# EAGLE design io_expansion_board (EAGLE 8.4.0)
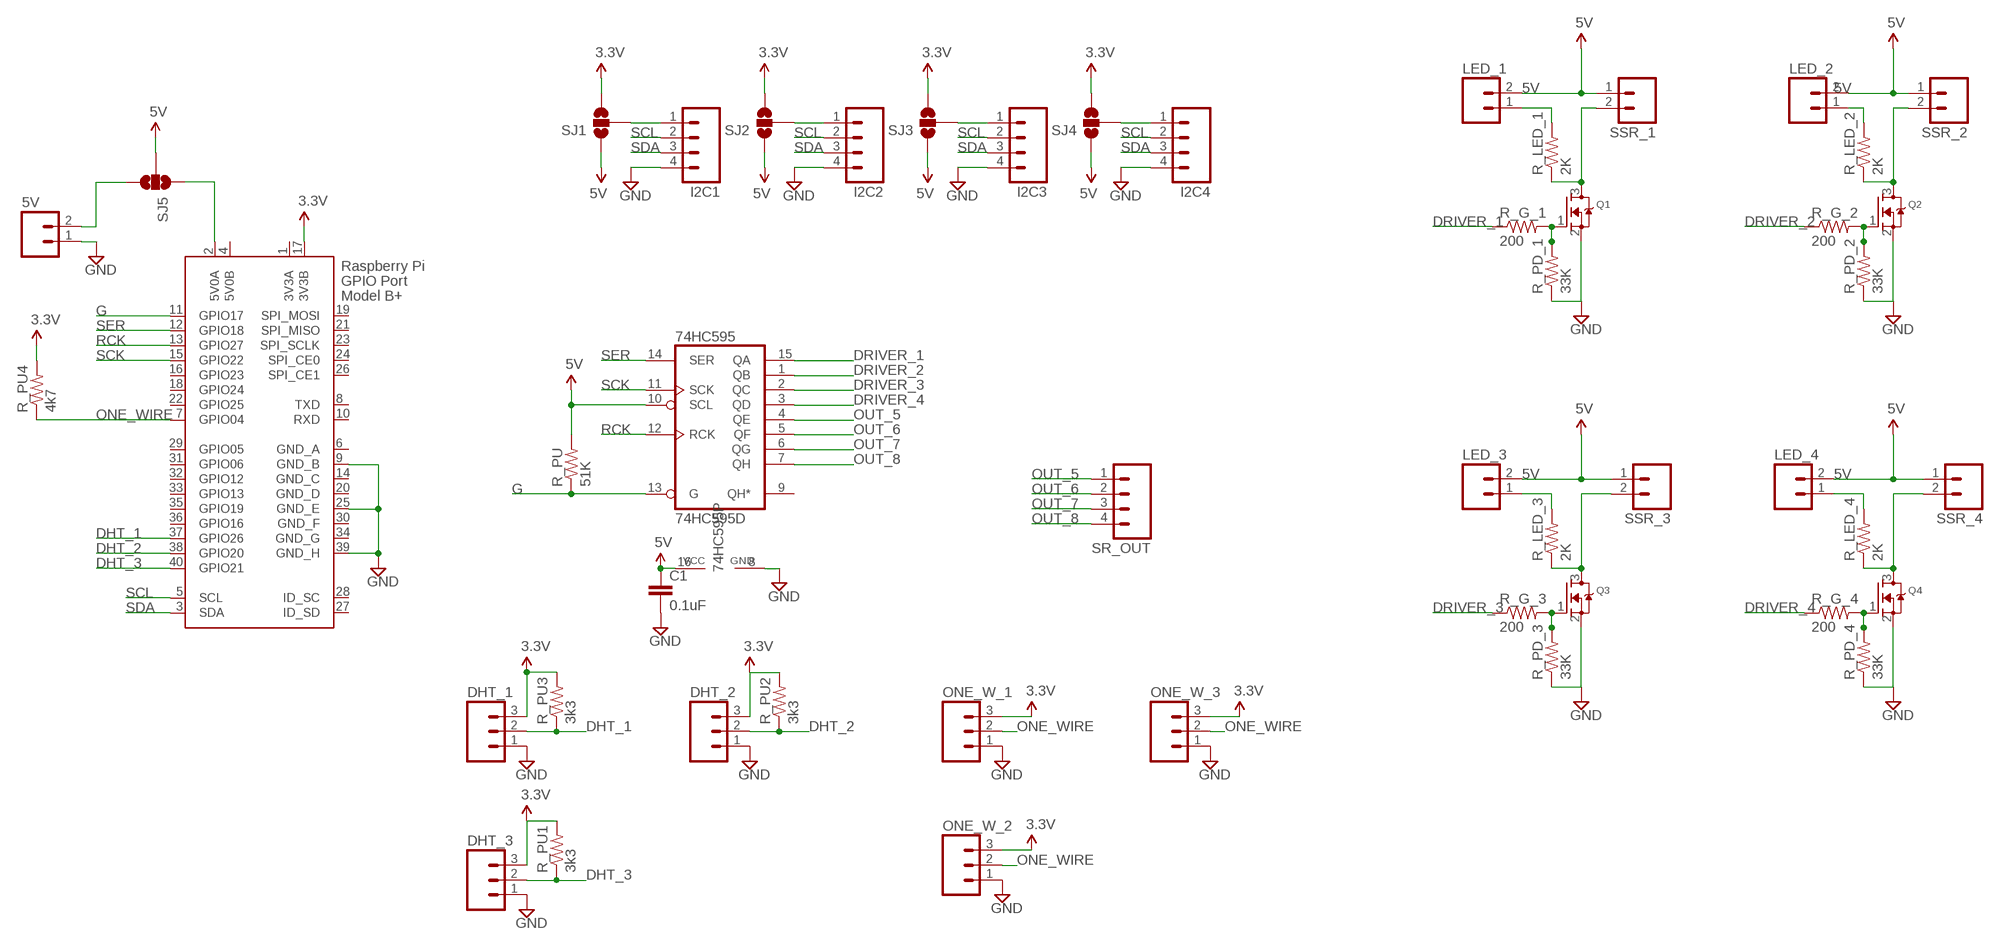
[diagram p0: schematic, sheet 1]

## Parts
5V  M023.5MM  [SCREWTERMINAL-3.5MM-2]
74HC595  74HC595D  [SO16]
C1  0.1uF  0.1UF-25V(+80/-20%)(0603)  [0603-CAP]
DHT_1  M03POLAR  [MOLEX-1X3]
DHT_2  M03POLAR  [MOLEX-1X3]
DHT_3  M03POLAR  [MOLEX-1X3]
I2C1  M04PTH  [1X04]
I2C2  M04PTH  [1X04]
I2C3  M04PTH  [1X04]
I2C4  M04PTH  [1X04]
LED_1  M02PTH  [1X02]
LED_2  M02PTH  [1X02]
LED_3  M02PTH  [1X02]
LED_4  M02PTH  [1X02]
ONE_W_1  M03POLAR  [MOLEX-1X3]
ONE_W_2  M03POLAR  [MOLEX-1X3]
ONE_W_3  M03POLAR  [MOLEX-1X3]
Q1  MOSFET-NREFLOW  [SOT23]
Q2  MOSFET-NREFLOW  [SOT23]
Q3  MOSFET-NREFLOW  [SOT23]
Q4  MOSFET-NREFLOW  [SOT23]
R_G_1  200  RESISTOR0603  [0603-RES]
R_G_2  200  RESISTOR0603  [0603-RES]
R_G_3  200  RESISTOR0603  [0603-RES]
R_G_4  200  RESISTOR0603  [0603-RES]
R_LED_1  2K  RESISTOR0603  [0603-RES]
R_LED_2  2K  RESISTOR0603  [0603-RES]
R_LED_3  2K  RESISTOR0603  [0603-RES]
R_LED_4  2K  RESISTOR0603  [0603-RES]
R_PD_1  33K  RESISTOR0603  [0603-RES]
R_PD_2  33K  RESISTOR0603  [0603-RES]
R_PD_3  33K  RESISTOR0603  [0603-RES]
R_PD_4  33K  RESISTOR0603  [0603-RES]
R_PU  51K  RESISTOR0603  [0603-RES]
R_PU1  3k3  RESISTOR0603  [0603-RES]
R_PU2  3k3  RESISTOR0603  [0603-RES]
R_PU3  3k3  RESISTOR0603  [0603-RES]
R_PU4  4k7  RESISTOR0603  [0603-RES]
SJ1  SOLDERJUMPER_2WAYS  [SJ_3]
SJ2  SOLDERJUMPER_2WAYS  [SJ_3]
SJ3  SOLDERJUMPER_2WAYS  [SJ_3]
SJ4  SOLDERJUMPER_2WAYS  [SJ_3]
SJ5  SOLDERJUMPER_2WAYS  [SJ_3]
SR_OUT  M04PTH  [1X04]
SSR_1  M02PTH  [1X02]
SSR_2  M02PTH  [1X02]
SSR_3  M02PTH  [1X02]
SSR_4  M02PTH  [1X02]
X2  RASPI_BOARD_B+#_HDC  [RASPI_BOARD_B+HAT_DF_CF]

## Nets
3.3V: DHT_1.3 DHT_2.3 DHT_3.3 ONE_W_1.3 ONE_W_2.3 ONE_W_3.3 R_PU1.2 R_PU2.2 R_PU3.2 R_PU4.2 SJ1.3 SJ2.3 SJ3.3 SJ4.3 X2.17(3V3B)
5V: 74HC595.10(SCL) 74HC595.16(VCC) C1.1 LED_1.2 LED_2.2 LED_3.2 LED_4.2 R_PU.2 SJ1.1 SJ2.1 SJ3.1 SJ4.1 SJ5.2 SSR_1.1 SSR_2.1 SSR_3.1 SSR_4.1
DHT_1: DHT_1.2 R_PU3.1 X2.37(GPIO26)
DHT_2: DHT_2.2 R_PU2.1 X2.38(GPIO20)
DHT_3: DHT_3.2 R_PU1.1 X2.40(GPIO21)
DRIVER_1: 74HC595.15(QA) R_G_1.1
DRIVER_2: 74HC595.1(QB) R_G_2.1
DRIVER_3: 74HC595.2(QC) R_G_3.1
DRIVER_4: 74HC595.3(QD) R_G_4.1
G: 74HC595.13(G) R_PU.1 X2.11(GPIO17)
GND: 5V.1 74HC595.8(GND) C1.2 DHT_1.1 DHT_2.1 DHT_3.1 I2C1.4(GND) I2C2.4(GND) I2C3.4(GND) I2C4.4(GND) ONE_W_1.1 ONE_W_2.1 ONE_W_3.1 Q1.2(S) Q2.2(S) Q3.2(S) Q4.2(S) R_PD_1.1 R_PD_2.1 R_PD_3.1 R_PD_4.1 X2.9(GND_B) X2.25(GND_E) X2.39(GND_H)
N$1: Q2.1(G) R_G_2.2 R_PD_2.2
N$2: Q2.3(D) R_LED_2.1 SSR_2.2
N$3: LED_2.1 R_LED_2.2
N$4: Q3.1(G) R_G_3.2 R_PD_3.2
N$5: Q1.1(G) R_G_1.2 R_PD_1.2
N$6: Q1.3(D) R_LED_1.1 SSR_1.2
N$7: LED_1.1 R_LED_1.2
N$8: Q3.3(D) R_LED_3.1 SSR_3.2
N$9: LED_3.1 R_LED_3.2
N$10: Q4.1(G) R_G_4.2 R_PD_4.2
N$11: Q4.3(D) R_LED_4.1 SSR_4.2
N$12: LED_4.1 R_LED_4.2
N$13: I2C1.1(SCL) SJ1.2
N$14: I2C2.1(SCL) SJ2.2
N$15: I2C3.1(SCL) SJ3.2
N$16: I2C4.1(SCL) SJ4.2
N$17: SJ5.1 X2.2(5V0A)
N$18: 5V.2 SJ5.3
ONE_WIRE: ONE_W_1.2 ONE_W_2.2 ONE_W_3.2 R_PU4.1 X2.7(GPIO04)
OUT_5: 74HC595.4(QE) SR_OUT.1(SCL)
OUT_6: 74HC595.5(QF) SR_OUT.2(SDA)
OUT_7: 74HC595.6(QG) SR_OUT.3(VCC)
OUT_8: 74HC595.7(QH) SR_OUT.4(GND)
RCK: 74HC595.12(RCK) X2.13(GPIO27)
SCK: 74HC595.11(SCK) X2.15(GPIO22)
SCL: I2C1.2(SDA) I2C2.2(SDA) I2C3.2(SDA) I2C4.2(SDA) X2.5(SCL)
SDA: I2C1.3(VCC) I2C2.3(VCC) I2C3.3(VCC) I2C4.3(VCC) X2.3(SDA)
SER: 74HC595.14(SER) X2.12(GPIO18)
Unconnected: 74HC595.9(QH*) X2.8(TXD) X2.10(RXD) X2.16(GPIO23) X2.18(GPIO24) X2.19(SPI_MOSI) X2.21(SPI_MISO) X2.22(GPIO25) X2.23(SPI_SCLK) X2.24(SPI_CE0) X2.26(SPI_CE1) X2.27(ID_SD) X2.28(ID_SC) X2.29(GPIO05) X2.31(GPIO06) X2.32(GPIO12) X2.33(GPIO13) X2.35(GPIO19) X2.36(GPIO16)

## Power pins joined to a net without a drawn wire
3V3A: X2.1(3V3A)
5V0B: X2.4(5V0B)
GND_A: X2.6(GND_A)
GND_C: X2.14(GND_C)
GND_D: X2.20(GND_D)
GND_F: X2.30(GND_F)
GND_G: X2.34(GND_G)

## Library data of the parts
5V = SparkFun-Connectors:M02: Standard 2-pin 0.1" header. Use with - straight break away headers ( PRT-00116) - right angle break away headers (PRT-00553) - swiss pins (PRT-00743) - machine pins (PRT-00117) - female headers (PRT-00115) Molex polarized connector foot print use with: PRT-08233 with associated crimp pins and housings. 2.54_SCREWTERM for use with PRT-10571. 3.5mm Screw Terminal footprints for PRT-08084 5mm Screw Terminal footprints for use with PRT-08432; PROD_ID: CONN-08399
74HC595 = 74xx-eu:74*595: 8-bit SHIFT REGISTER, output latch
C1 = SparkFun-Capacitors:0.1UF-25V(+80/-20%)(0603): CAP-00810 Ceramic Standard decoupling cap; PROD_ID: CAP-00810
DHT_1-DHT_3 ONE_W_1-ONE_W_3 = SparkFun-Connectors:M03: Header 3 Standard 3-pin 0.1" header. Use with straight break away headers (SKU : PRT-00116), right angle break away headers (PRT-00553), swiss pins (PRT-00743), machine pins (PRT-00117), and female headers (PRT-00115). Molex polarized connector foot print use with SKU : PRT-08232 with associated crimp pins and housings.
I2C1-I2C4 SR_OUT = SparkFun-Connectors:M04: Header 4 Standard 4-pin 0.1" header. Use with straight break away headers (SKU : PRT-00116), right angle break away headers (PRT-00553), swiss pins (PRT-00743), machine pins (PRT-00117), and female headers (PRT-00115). Molex polarized connector foot print use with SKU : PRT-08231 with associated crimp pins and housings. 1MM SMD Version SKU: PRT-10208
LED_1-LED_4 SSR_1-SSR_4 = SparkFun-Connectors:M02: Standard 2-pin 0.1" header. Use with - straight break away headers ( PRT-00116) - right angle break away headers (PRT-00553) - swiss pins (PRT-00743) - machine pins (PRT-00117) - female headers (PRT-00115) Molex polarized connector foot print use with: PRT-08233 with associated crimp pins and housings. 2.54_SCREWTERM for use with PRT-10571. 3.5mm Screw Terminal footprints for PRT-08084 5mm Screw Terminal footprints for use with PRT-08432
Q1-Q4 = adafruit:MOSFET-N: N-Channel Mosfet 2N7002E - 60V 260mA SOT23 [Digikey: 2N7002ET1GOSTR-ND] - REEL BSH103 - 30V 850mA SOT23 [Digikey: 568-5013-1-ND]
R_G_1-R_G_4 R_LED_1-R_LED_4 R_PD_1-R_PD_4 R_PU R_PU1-R_PU4 = SparkFun-Resistors:RESISTOR: Resistor Basic schematic elements and footprints for 0603, 1206, and PTH resistors.
SJ1-SJ5 = SparkFun-Retired:SOLDERJUMPER_2WAY: Solder Jumper 2 way solder jumper
X2 = raspberrypi_bastelstube_v13:RASPI_BOARD_B+#: Raspberry Pi GPIO connector with markings for the outer dimensions of the Raspberry Pi board model B+ with different sets of drill holes or mounting pads All pins connected

## Board
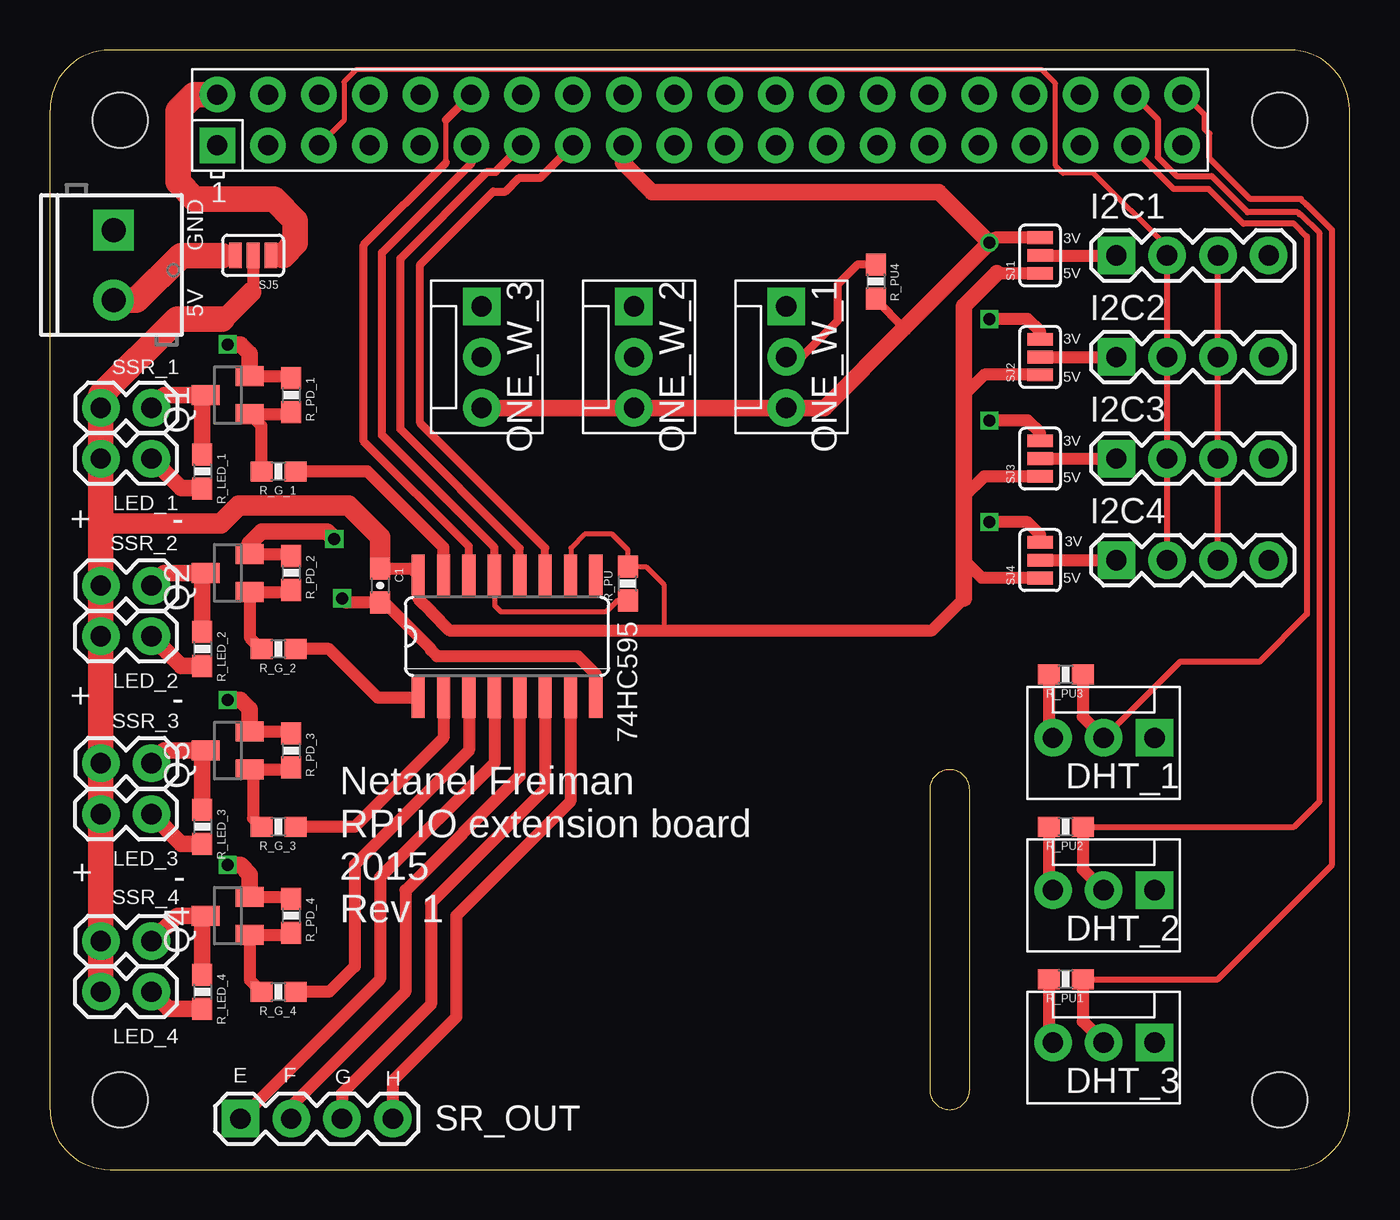
[diagram p1: board, top side]
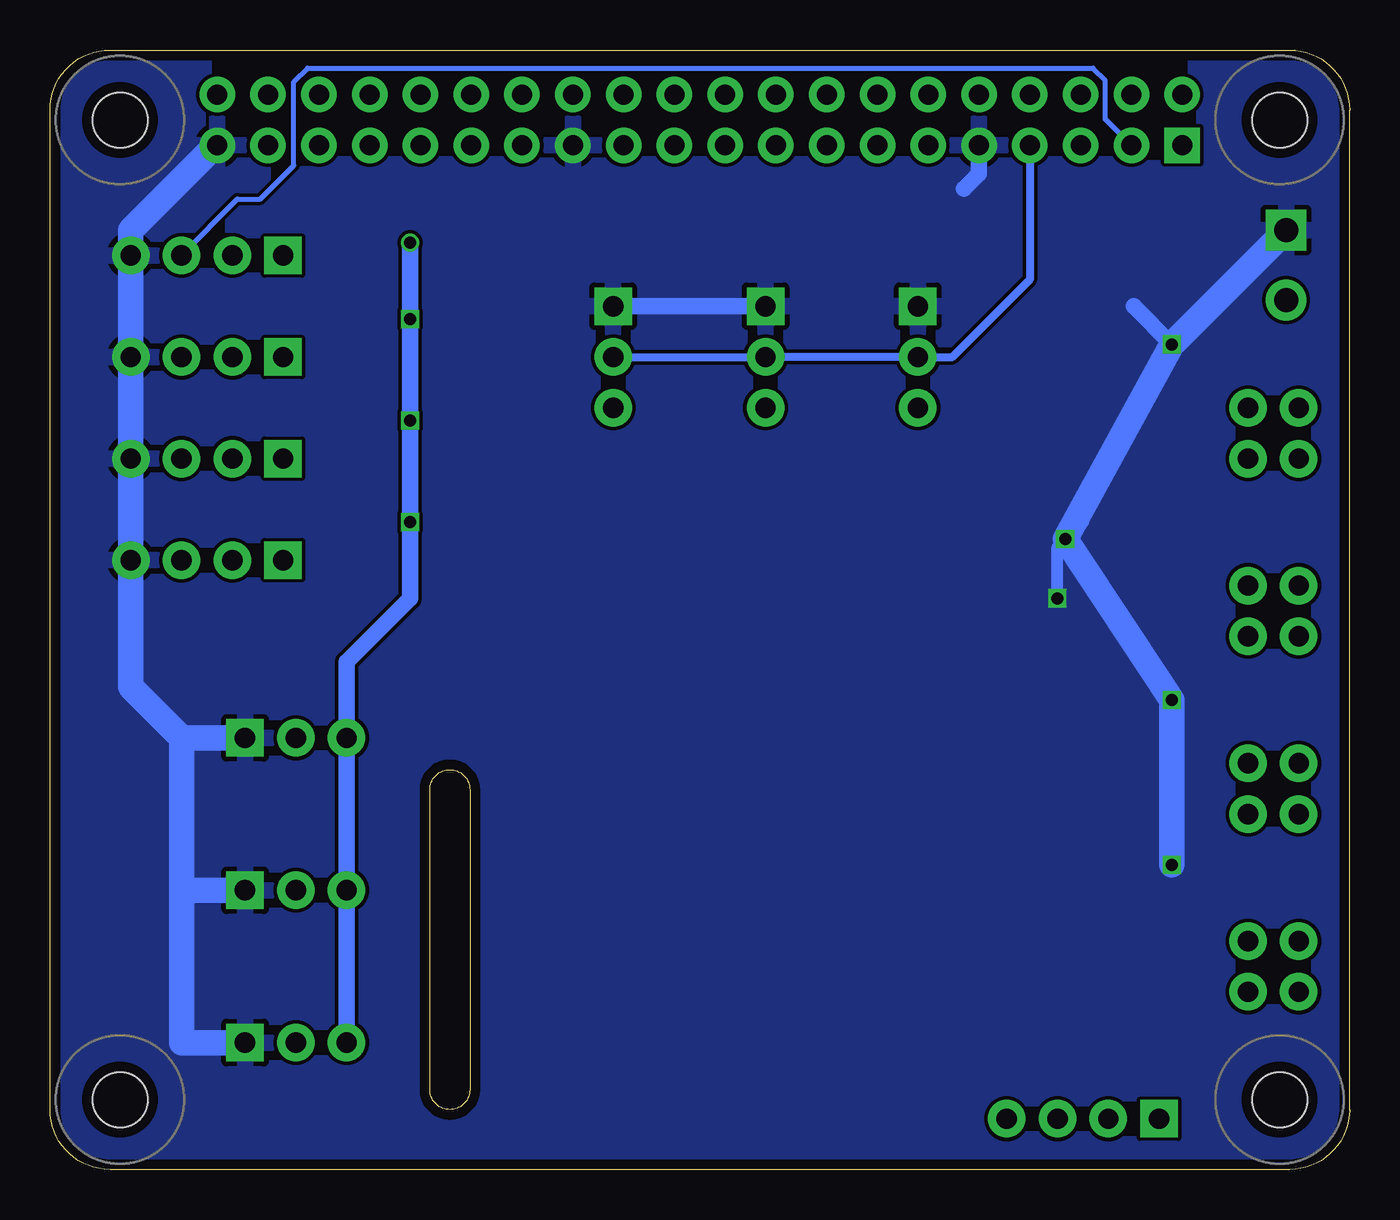
[diagram p2: board, bottom side, seen from below]

Size 65 x 56 mm. Coordinates in mm from the lower left corner, seen from the top.
Copper layers (1*16): Top 0.035mm / dielectric 1.5mm / Bottom 0.035mm
Design rules "SmartprototypingEagleRules": minimum track width 7mil, minimum drill 12mil, track to track 7mil, track to pad 7mil, pad to pad 7mil, via to via 7mil, smd to smd 0mil, copper to edge 20mil, drill to drill 10mil, minimum pad ring 10mil, minimum via ring 6mil, stop-mask expansion 2mil, vias tented up to drill 25mil, thermal gap 10mil

### Footprints (pad centres in the part's own frame; a part is rotated, then mirrored left to right if it is on the bottom)
SCREWTERMINAL-3.5MM-2 = drill 1.2 pad 2.032 square: 1 0,0 | drill 1.2 pad 2.032: 2 3.5,0
SO16 = smd 0.66 x 2.032: 1 -4.445,-3.073; 2 -3.175,-3.073; 3 -1.905,-3.073; 4 -0.635,-3.073; 5 0.635,-3.073; 6 1.905,-3.073; 7 3.175,-3.073; 8 4.445,-3.073; 9 4.445,3.073; 10 3.175,3.073; 11 1.905,3.073; 12 0.635,3.073; 13 -0.635,3.073; 14 -1.905,3.073; 15 -3.175,3.073; 16 -4.445,3.073
0603-CAP = smd 1.1 x 1: 1 -0.85,0; 2 0.85,0
MOLEX-1X3 = drill 1.016 pad 1.88 square: 1 0,0 | drill 1.016 pad 1.88: 2 2.54,0; 3 5.08,0
1X04 = drill 1.016 pad 1.88 square: 1 0,0 | drill 1.016 pad 1.88: 2 2.54,0; 3 5.08,0; 4 7.62,0
1X02 = drill 1.016 pad 1.88: 1 0,0; 2 2.54,0
SOT23 = smd 1 x 1.4: 1 -0.95,-1.1; 2 0.95,-1.1; 3 0,1.1
0603-RES = smd 1.1 x 1: 1 -0.85,0; 2 0.85,0
SJ_3 = smd 0.635 x 1.27: 1 -0.889,0; 2 0,0; 3 0.889,0
RASPI_BOARD_B+HAT_DF_CF = drill 1 pad 1.778 square: 1 8.37,51.23 | drill 1 pad 1.778: 2 8.37,53.77; 3 10.91,51.23; 4 10.91,53.77; 5 13.45,51.23; 6 13.45,53.77; 7 15.99,51.23; 8 15.99,53.77; 9 18.53,51.23; 10 18.53,53.77; 11 21.07,51.23; 12 21.07,53.77; 13 23.61,51.23; 14 23.61,53.77; 15 26.15,51.23; 16 26.15,53.77; 17 28.69,51.23; 18 28.69,53.77; 19 31.23,51.23; 20 31.23,53.77; 21 33.77,51.23; 22 33.77,53.77; 23 36.31,51.23; 24 36.31,53.77; 25 38.85,51.23; 26 38.85,53.77; 27 41.39,51.23; 28 41.39,53.77; 29 43.93,51.23; 30 43.93,53.77; 31 46.47,51.23; 32 46.47,53.77; 33 49.01,51.23; 34 49.01,53.77; 35 51.55,51.23; 36 51.55,53.77; 37 54.09,51.23; 38 54.09,53.77; 39 56.63,51.23; 40 56.63,53.77 | hole 2.75: 3.5,3.5; 3.5,52.5; 61.5,3.5; 61.5,52.5

### Placement (x,y rotation side)
5V  3.17,46.99 270 top
74HC595  22.86,26.67 0 top
C1  16.51,29.21 270 top
DHT_1  55.24,21.59 180 top
DHT_2  55.24,13.97 180 top
DHT_3  55.24,6.35 180 top
I2C1  53.34,45.72 0 top
I2C2  53.34,40.64 0 top
I2C3  53.34,35.56 0 top
I2C4  53.34,30.48 0 top
LED_1  5.08,35.56 180 top
LED_2  5.08,26.67 180 top
LED_3  5.08,17.78 180 top
LED_4  5.08,8.89 180 top
ONE_W_1  36.83,43.18 270 top
ONE_W_2  29.21,43.18 270 top
ONE_W_3  21.59,43.18 270 top
Q1  8.89,38.73 90 top
Q2  8.89,29.84 90 top
Q3  8.89,20.95 90 top
Q4  8.89,12.7 90 top
R_G_1  11.43,34.92 180 top
R_G_2  11.43,26.04 180 top
R_G_3  11.43,17.14 180 top
R_G_4  11.43,8.89 180 top
R_LED_1  7.62,34.92 270 top
R_LED_2  7.62,26.04 270 top
R_LED_3  7.62,17.14 270 top
R_LED_4  7.62,8.89 270 top
R_PD_1  12.06,38.73 270 top
R_PD_2  12.06,29.84 270 top
R_PD_3  12.06,20.95 270 top
R_PD_4  12.06,12.7 270 top
R_PU  28.91,29.31 90 top
R_PU1  50.8,9.53 180 top
R_PU2  50.8,17.14 180 top
R_PU3  50.8,24.77 180 top
R_PU4  41.3,44.42 270 top
SJ1  49.53,45.72 90 top
SJ2  49.53,40.64 90 top
SJ3  49.53,35.56 90 top
SJ4  49.53,30.48 90 top
SJ5  10.16,45.72 180 top
SR_OUT  9.53,2.54 0 top
SSR_1  2.54,38.1 0 top
SSR_2  2.54,29.21 0 top
SSR_3  2.54,20.32 0 top
SSR_4  2.54,11.43 0 top
X2  0,0 0 top

### Tracks (layer width: path | path; a pad name or v marks a point on that pad's centre or on a via)
3.3V  (via drill 0.6)
  Top 0.406: R_PU4.2 41.3,43.51 42.72,42.09
  Top 0.61: SJ3.3 49.53,36.83 48.9,37.47 v46.99,37.47 | SJ4.3 49.53,31.75 48.9,32.38 v46.99,32.38 | SJ2.3 49.53,41.91 48.9,42.55 v46.99,42.55 | SJ1.3 47.24,46.61 v46.99,46.35 | R_PU1.2 49.95,6.57 DHT_3.3 | R_PU2.2 49.95,14.19 DHT_2.3 | R_PU3.2 49.95,21.8 DHT_1.3
  Top 0.813: ONE_W_3.3 ONE_W_2.3 ONE_W_1.3 38.73,38.1 42.72,42.09 v46.99,46.35 44.45,48.9 30.12,48.9 28.65,50.37 28.65,51.19 X2.17
  Bottom 0.813: v46.99,46.35 v46.99,42.55 v46.99,37.47 v46.99,32.38 46.99,28.57 50.16,25.4 DHT_1.3 DHT_2.3 DHT_3.3
5V
  Top 0.254: 30.79,26.98 30.71,27.05 30.71,29.26 29.81,30.16 R_PU.2 28.91,30.99 28.12,31.77 26.75,31.77 26.06,31.09 26.06,29.77 74HC595.10
  Top 0.61: SJ3.1 46.74,34.67 45.72,33.66 | SJ2.1 46.74,39.75 45.72,38.73 | 47.37,44.83 SJ1.1 | SJ4.1 46.61,29.59 45.72,30.48 | C1.1 18.1,30.06 74HC595.16 18.41,28.57 19.05,27.94 19.05,27.89 19.96,26.98 30.79,26.98 44.12,26.98 45.72,28.57 | SJ5.2 10.16,44.09 8.61,42.55
  Top 0.813: 47.37,44.83 45.72,43.18 45.72,38.73 45.72,33.66 45.72,30.48 45.72,28.57
  Top 1.016: 8.61,42.55 8.71,42.55 10.06,43.89 | C1.1 16.51,31.65 14.94,33.22 9.45,33.22 8.53,32.31 2.54,32.31
  Top 1.27: 8.61,42.55 6.35,42.55 2.54,38.73 SSR_1.1 LED_1.2 2.54,32.31 SSR_2.1 LED_2.2 SSR_3.1 LED_3.2 SSR_4.1 LED_4.2
DHT_1
  Top 0.305: X2.37 54.09,51.16 56.2,49.05 57.94,49.05 59.69,47.31 62.23,47.31 62.87,46.67 62.87,27.78 60.48,25.4 56.52,25.4 DHT_1.2
  Top 0.61: R_PU3.1 51.65,22.64 DHT_1.2
DHT_2
  Top 0.305: R_PU2.1 62.23,17.14 63.5,18.41 63.5,46.83 62.55,47.78 62.5,47.78 62.41,47.88 59.91,47.88 58.1,49.69 56.36,49.69 55.4,50.64 55.4,52.55 54.18,53.77 X2.38
  Top 0.61: R_PU2.1 51.65,15.03 DHT_2.2
DHT_3
  Top 0.305: R_PU1.1 58.42,9.53 64.14,15.24 64.14,46.99 62.87,48.26 62.85,48.26 62.57,48.54 60.05,48.54 57.99,50.6 57.99,51.82 57.76,52.05 57.76,52.68 57.78,52.7 56.72,53.77 X2.40
  Top 0.61: R_PU1.1 51.65,7.41 DHT_3.2
DRIVER_1
  Top 0.61: 74HC595.15 19.68,31.11 15.88,34.92 R_G_1.1
DRIVER_2
  Top 0.61: 74HC595.1 16.41,23.6 13.97,26.04 R_G_2.1
DRIVER_3
  Top 0.61: 74HC595.2 19.68,21.59 15.24,17.14 R_G_3.1
DRIVER_4
  Top 0.61: 74HC595.3 20.95,20.95 15.24,15.24 15.24,10.16 13.97,8.89 R_G_4.1
G
  Top 0.254: R_PU.1 28.39,28.46 27.81,27.89 22.55,27.89 22.25,28.19 22.25,29.72 74HC595.13
  Top 0.406: 74HC595.13 22.23,31.11 16.61,36.73 16.61,45.87 21.11,50.37 21.11,51.19 X2.11
GND  (via drill 0.6)
  Top 0.61: Q1.2 11.96,39.69 R_PD_1.1 | Q4.2 11.96,13.65 R_PD_4.1 | Q3.2 11.96,21.91 R_PD_3.1 | Q2.2 11.96,30.8 R_PD_2.1 | 74HC595.8 27.3,24.77 26.39,25.68 19.36,25.68 19.05,25.98 19.05,26.04 16.73,28.36 C1.2 14.82,28.36 v14.61,28.57
  Top 0.813: Q1.2 9.99,40.81 9.53,41.27 v8.89,41.27 | Q3.2 9.99,23.03 9.53,23.5 v8.89,23.5 | Q4.2 9.99,14.78 9.53,15.24 v8.89,15.24 | v14.22,31.55 13.85,31.92 10.59,31.92 9.99,31.32 Q2.2
  Bottom 0.61: v14.61,28.57 14.61,31.11 13.34,32.38 v14.22,31.55
  Bottom 0.813: 10.79,43.18 v8.89,41.27 | ONE_W_2.1 ONE_W_1.1 | X2.9 18.53,49.82 19.28,49.07
  Bottom 1.27: X2.39 56.72,51.23 60.96,46.99 I2C1.4 I2C2.4 I2C3.4 I2C4.4 60.96,24.13 58.42,21.59 | 58.42,21.59 DHT_1.1 | DHT_2.1 58.42,13.97 | 58.42,13.97 58.42,21.59 | DHT_3.1 58.42,6.35 58.42,13.97 | 5V.1 v8.89,41.27 v14.22,31.55 v8.89,23.5 v8.89,15.24
  pour Bottom: -1.45,57.68 66.83,57.68 66.83,-2.74 -1.6,-2.74 -1.6,57.45 -1.52,57.45 -1.52,57.68
N$1
  Top 0.61: R_G_2.2 9.99,26.62 Q2.1 11.96,28.89 R_PD_2.2
N$2
  Top 0.813: R_LED_2.1 7.62,29.68 Q2.3 5.71,29.84 SSR_2.2
N$3
  Top 0.813: R_LED_2.2 6.57,25.18 LED_2.1
N$4
  Top 0.61: R_PD_3.2 11.96,20 Q3.1 9.99,19.86 10.16,19.68 10.16,17.57 R_G_3.2
N$5
  Top 0.61: R_G_1.2 10.58,37.2 Q1.1 11.96,37.78 R_PD_1.2
N$6
  Top 0.813: SSR_1.2 5.71,38.73 Q1.3 7.62,38.56 R_LED_1.1
N$7
  Top 0.813: R_LED_1.2 6.57,34.08 LED_1.1
N$8
  Top 0.813: R_LED_3.1 7.62,20.79 Q3.3 5.71,20.95 SSR_3.2
N$9
  Top 0.813: R_LED_3.2 6.57,16.3 LED_3.1
N$10
  Top 0.61: R_G_4.2 9.99,9.48 Q4.1 11.96,11.75 R_PD_4.2
N$11
  Top 0.813: SSR_4.2 6.35,12.7 Q4.3 7.62,12.53 R_LED_4.1
N$12
  Top 0.813: R_LED_4.2 5.93,8.04 LED_4.1
N$13
  Top 0.61: SJ1.2 I2C1.1
N$14
  Top 0.61: SJ2.2 I2C2.1
N$15
  Top 0.61: SJ3.2 I2C3.1
N$16
  Top 0.61: SJ4.2 I2C4.1
N$17
  Top 0.61: 11.66,45.72 SJ5.1
  Top 1.27: X2.2 7.21,53.77 6.4,52.96 6.4,49.38 7.24,48.54 11.2,48.54 12.27,47.47 12.27,46.33 11.66,45.72
N$18
  Top 0.61: 8.61,45.72 SJ5.3
  Top 1.27: 5V.2 4.32,43.49 6.55,45.72 8.61,45.72
ONE_WIRE
  Top 0.406: R_PU4.1 40.4,45.27 39.4,44.27 39.4,42.44 37.59,40.64 ONE_W_1.2
  Bottom 0.406: ONE_W_1.2 ONE_W_2.2 ONE_W_3.2 21.57,40.62 19.89,40.62 15.99,44.51 X2.7
OUT_5
  Top 0.61: 74HC595.4 22.23,20.32 16.51,14.61 16.51,9.53 SR_OUT.1
OUT_6
  Top 0.61: 74HC595.5 23.5,19.68 17.78,13.97 17.78,8.89 12.06,3.17 SR_OUT.2
OUT_7
  Top 0.61: 74HC595.6 24.77,19.05 19.05,13.34 19.05,8.26 14.61,3.81 SR_OUT.3
OUT_8
  Top 0.61: 74HC595.7 26.04,18.41 20.32,12.7 20.32,7.62 17.14,4.45 SR_OUT.4
RCK
  Top 0.406: 74HC595.12 23.5,31.06 17.53,37.03 17.53,45.57 21.87,49.91 22.29,49.91 X2.13
SCK
  Top 0.406: 74HC595.11 24.77,31.09 18.52,37.34 18.52,45.26 22.17,48.92 22.78,48.92 23.47,49.61 24.53,49.61 X2.15
SCL
  Top 0.254: I2C1.2 55.88,46.15 52.2,49.84 50.67,49.84 50.29,50.22 50.29,54.33 49.61,55.02 15.32,55.02 14.71,54.41 14.71,52.49 X2.5
  Top 0.305: I2C4.2 I2C3.2 I2C2.2 I2C1.2
SDA
  Top 0.305: I2C4.3 I2C3.3 I2C2.3 I2C1.3
  Bottom 0.254: I2C1.3 58.42,45.74 55.63,48.54 54.48,48.54 52.81,50.22 52.81,54.41 52.12,55.09 12.83,55.09 12.22,54.48 12.22,52.54 X2.3
SER
  Top 0.254: 19.81,50.37 19.81,52.51
  Top 0.406: 74HC595.14 20.95,31.17 15.7,36.42 15.7,46.25 19.81,50.37 | 19.81,52.51 X2.12

### Text on the board
tPlace: Netanel Freiman / RPi IO extension board / 2015 / Rev 1
tNames: GND | 3V | 5V | 3V | 5V | 3V | 5V | + | - | 3V | 5V | + | - | + | - | E | F | G | H